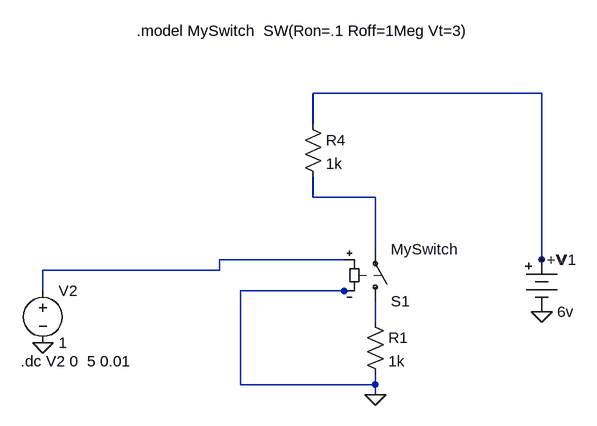
[diagram p0: schematic MySw1.asc]
MySw1.asc, the LTspice schematic file:
Version 4
SHEET 1 880 680
WIRE 544 -48 192 -48
WIRE 192 0 192 -48
WIRE 192 112 192 80
WIRE 288 112 192 112
WIRE 288 192 288 112
WIRE 240 208 48 208
WIRE 544 208 544 -48
WIRE 48 224 48 208
WIRE 48 224 -224 224
WIRE 544 224 544 208
WIRE -224 256 -224 224
WIRE 240 256 80 256
WIRE 256 256 240 256
WIRE 288 304 288 272
WIRE 80 400 80 256
WIRE 288 400 288 384
WIRE 288 400 80 400
WIRE 288 416 288 400
FLAG 544 288 0
FLAG 544 208 +V
FLAG 288 416 0
FLAG -224 336 0
SYMBOL Misc\\battery 544 192 R0
SYMATTR InstName V1
SYMATTR Value 6v
SYMBOL sw 288 288 M180
SYMATTR InstName S1
SYMATTR Value MySwitch
SYMBOL res 176 -16 R0
SYMATTR InstName R4
SYMATTR Value 1k
SYMBOL voltage -224 240 R0
SYMATTR InstName V2
SYMATTR Value 1
SYMBOL res 272 288 R0
SYMATTR InstName R1
SYMATTR Value 1k
TEXT -80 -144 Left 0 !.model MySwitch  SW(Ron=.1 Roff=1Meg Vt=3)
TEXT -258 364 Left 0 !.dc V2 0  5 0.01

The netlist it stands for:
* MySw1.asc
V1 +V 0 6v
S1 N003 N001 N002 0 MySwitch
R4 +V N001 1k
V2 N002 0 1
R1 N003 0 1k
.model MySwitch  SW(Ron=.1 Roff=1Meg Vt=3)
.dc V2 0  5 0.01
.backanno
.end